# EAGLE design ACCUMULATOR (EAGLE 9.5.2)
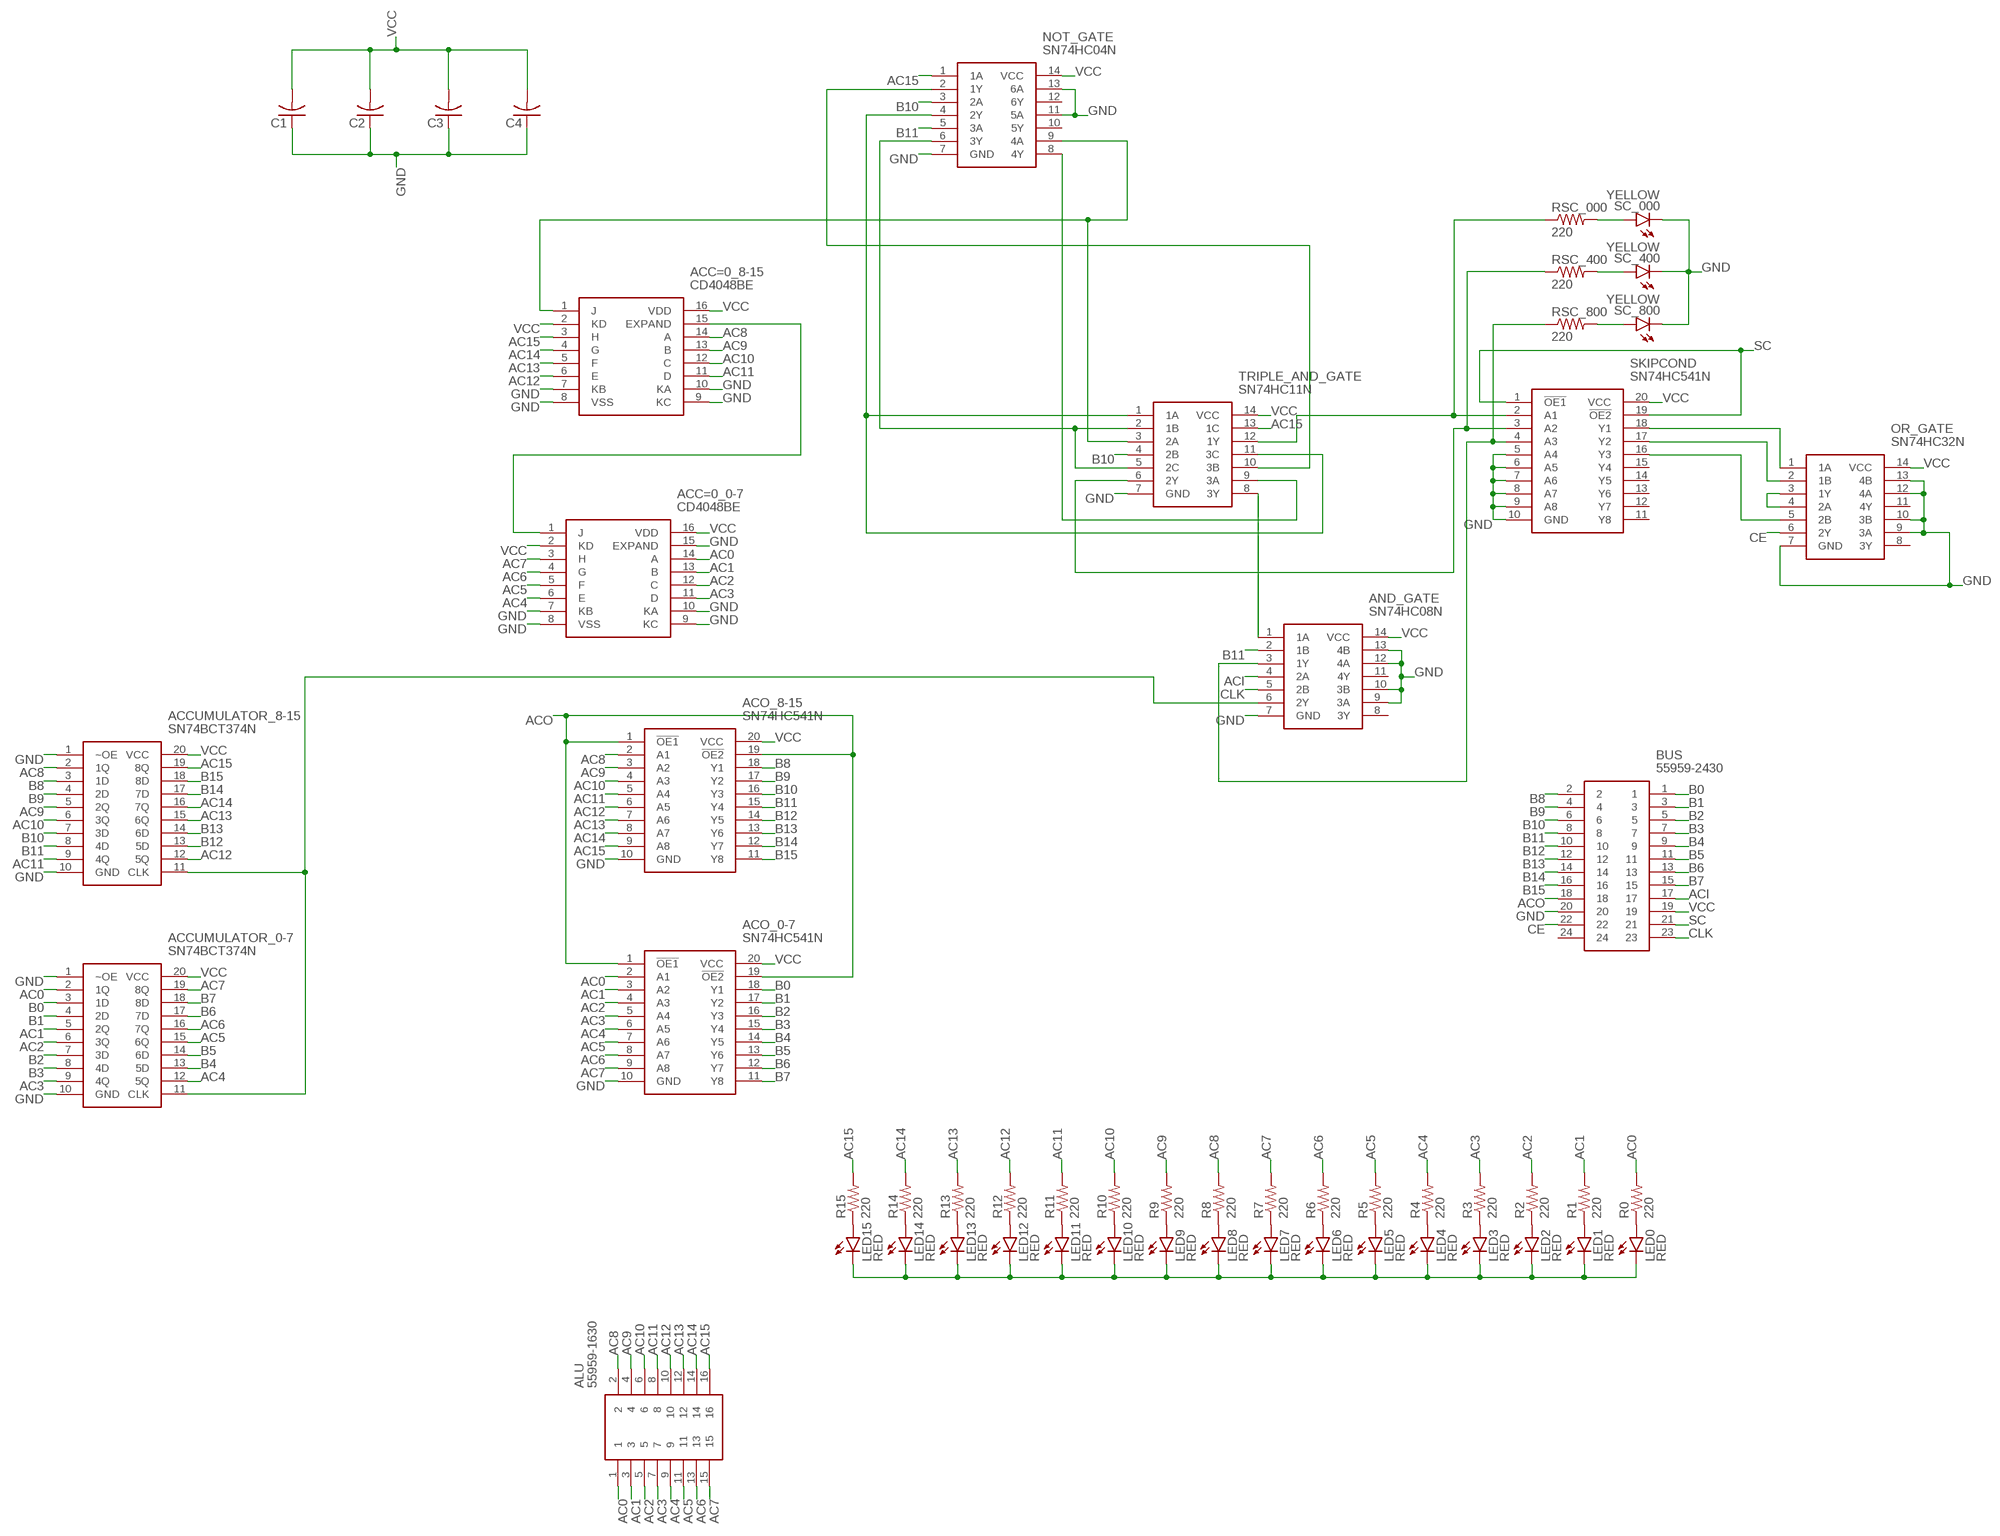
[diagram p0: schematic, sheet 1]

## Parts
ACC=0_0-7  CD4048BE  [DIP254P762X508-16]
ACC=0_8-15  CD4048BE  [DIP254P762X508-16]
ACCUMULATOR_0-7  SN74BCT374N  [DIP254P762X508-20]
ACCUMULATOR_8-15  SN74BCT374N  [DIP254P762X508-20]
ACO_0-7  SN74HC541N  [DIP794W53P254L2540H508Q20N]
ACO_8-15  SN74HC541N  [DIP794W53P254L2540H508Q20N]
ALU  55959-1630  [SHDR16W65P250X200_2X8_1940X140]
AND_GATE  SN74HC08N  [DIP794W53P254L1930H508Q14N]
BUS  55959-2430  [559592430]
C1  C-US025-024X044  [C025-024X044]
C2  C-US025-024X044  [C025-024X044]
C3  C-US025-024X044  [C025-024X044]
C4  C-US025-024X044  [C025-024X044]
LED0  RED  LED3MM  [LED3MM]
LED1  RED  LED3MM  [LED3MM]
LED2  RED  LED3MM  [LED3MM]
LED3  RED  LED3MM  [LED3MM]
LED4  RED  LED3MM  [LED3MM]
LED5  RED  LED3MM  [LED3MM]
LED6  RED  LED3MM  [LED3MM]
LED7  RED  LED3MM  [LED3MM]
LED8  RED  LED3MM  [LED3MM]
LED9  RED  LED3MM  [LED3MM]
LED10  RED  LED3MM  [LED3MM]
LED11  RED  LED3MM  [LED3MM]
LED12  RED  LED3MM  [LED3MM]
LED13  RED  LED3MM  [LED3MM]
LED14  RED  LED3MM  [LED3MM]
LED15  RED  LED3MM  [LED3MM]
NOT_GATE  SN74HC04N  [DIP794W53P254L1930H508Q14N]
OR_GATE  SN74HC32N  [DIP794W53P254L1930H508Q14N]
R0  220  R-US_0204/7  [0204/7]
R1  220  R-US_0204/7  [0204/7]
R2  220  R-US_0204/7  [0204/7]
R3  220  R-US_0204/7  [0204/7]
R4  220  R-US_0204/7  [0204/7]
R5  220  R-US_0204/7  [0204/7]
R6  220  R-US_0204/7  [0204/7]
R7  220  R-US_0204/7  [0204/7]
R8  220  R-US_0204/7  [0204/7]
R9  220  R-US_0204/7  [0204/7]
R10  220  R-US_0204/7  [0204/7]
R11  220  R-US_0204/7  [0204/7]
R12  220  R-US_0204/7  [0204/7]
R13  220  R-US_0204/7  [0204/7]
R14  220  R-US_0204/7  [0204/7]
R15  220  R-US_0204/7  [0204/7]
RSC_000  220  R-US_0204/7  [0204/7]
RSC_400  220  R-US_0204/7  [0204/7]
RSC_800  220  R-US_0204/7  [0204/7]
SC_000  YELLOW  LED3MM  [LED3MM]
SC_400  YELLOW  LED3MM  [LED3MM]
SC_800  YELLOW  LED3MM  [LED3MM]
SKIPCOND  SN74HC541N  [DIP794W53P254L2540H508Q20N]
TRIPLE_AND_GATE  SN74HC11N  [DIP794W53P254L1930H508Q14N]

## Nets
AC0: ACC=0_0-7.14(A) ACCUMULATOR_0-7.2(1Q) ACO_0-7.2(A1) ALU.1 R0.2
AC1: ACC=0_0-7.13(B) ACCUMULATOR_0-7.5(2Q) ACO_0-7.3(A2) ALU.3 R1.2
AC2: ACC=0_0-7.12(C) ACCUMULATOR_0-7.6(3Q) ACO_0-7.4(A3) ALU.5 R2.2
AC3: ACC=0_0-7.11(D) ACCUMULATOR_0-7.9(4Q) ACO_0-7.5(A4) ALU.7 R3.2
AC4: ACC=0_0-7.6(E) ACCUMULATOR_0-7.12(5Q) ACO_0-7.6(A5) ALU.9 R4.2
AC5: ACC=0_0-7.5(F) ACCUMULATOR_0-7.15(6Q) ACO_0-7.7(A6) ALU.11 R5.2
AC6: ACC=0_0-7.4(G) ACCUMULATOR_0-7.16(7Q) ACO_0-7.8(A7) ALU.13 R6.2
AC7: ACC=0_0-7.3(H) ACCUMULATOR_0-7.19(8Q) ACO_0-7.9(A8) ALU.15 R7.2
AC8: ACC=0_8-15.14(A) ACCUMULATOR_8-15.2(1Q) ACO_8-15.2(A1) ALU.2 R8.2
AC9: ACC=0_8-15.13(B) ACCUMULATOR_8-15.5(2Q) ACO_8-15.3(A2) ALU.4 R9.2
AC10: ACC=0_8-15.12(C) ACCUMULATOR_8-15.6(3Q) ACO_8-15.4(A3) ALU.6 R10.2
AC11: ACC=0_8-15.11(D) ACCUMULATOR_8-15.9(4Q) ACO_8-15.5(A4) ALU.8 R11.2
AC12: ACC=0_8-15.6(E) ACCUMULATOR_8-15.12(5Q) ACO_8-15.6(A5) ALU.10 R12.2
AC13: ACC=0_8-15.5(F) ACCUMULATOR_8-15.15(6Q) ACO_8-15.7(A6) ALU.12 R13.2
AC14: ACC=0_8-15.4(G) ACCUMULATOR_8-15.16(7Q) ACO_8-15.8(A7) ALU.14 R14.2
AC15: ACC=0_8-15.3(H) ACCUMULATOR_8-15.19(8Q) ACO_8-15.9(A8) ALU.16 NOT_GATE.1(1A) R15.2 TRIPLE_AND_GATE.13(1C)
ACI: AND_GATE.4(2A) BUS.17
ACO: ACO_0-7.1(!OE1) ACO_0-7.19(!OE2) ACO_8-15.1(!OE1) ACO_8-15.19(!OE2) BUS.18
B0: ACCUMULATOR_0-7.3(1D) ACO_0-7.18(Y1) BUS.1
B1: ACCUMULATOR_0-7.4(2D) ACO_0-7.17(Y2) BUS.3
B2: ACCUMULATOR_0-7.7(3D) ACO_0-7.16(Y3) BUS.5
B3: ACCUMULATOR_0-7.8(4D) ACO_0-7.15(Y4) BUS.7
B4: ACCUMULATOR_0-7.13(5D) ACO_0-7.14(Y5) BUS.9
B5: ACCUMULATOR_0-7.14(6D) ACO_0-7.13(Y6) BUS.11
B6: ACCUMULATOR_0-7.17(7D) ACO_0-7.12(Y7) BUS.13
B7: ACCUMULATOR_0-7.18(8D) ACO_0-7.11(Y8) BUS.15
B8: ACCUMULATOR_8-15.3(1D) ACO_8-15.18(Y1) BUS.2
B9: ACCUMULATOR_8-15.4(2D) ACO_8-15.17(Y2) BUS.4
B10: ACCUMULATOR_8-15.7(3D) ACO_8-15.16(Y3) BUS.6 NOT_GATE.3(2A) TRIPLE_AND_GATE.4(2B)
B11: ACCUMULATOR_8-15.8(4D) ACO_8-15.15(Y4) AND_GATE.2(1B) BUS.8 NOT_GATE.5(3A)
B12: ACCUMULATOR_8-15.13(5D) ACO_8-15.14(Y5) BUS.10
B13: ACCUMULATOR_8-15.14(6D) ACO_8-15.13(Y6) BUS.12
B14: ACCUMULATOR_8-15.17(7D) ACO_8-15.12(Y7) BUS.14
B15: ACCUMULATOR_8-15.18(8D) ACO_8-15.11(Y8) BUS.16
CE: BUS.22 OR_GATE.6(2Y)
CLK: AND_GATE.5(2B) BUS.23
GND: ACC=0_0-7.7(KB) ACC=0_0-7.8(VSS) ACC=0_0-7.9(KC) ACC=0_0-7.10(KA) ACC=0_0-7.15(EXPAND) ACC=0_8-15.7(KB) ACC=0_8-15.8(VSS) ACC=0_8-15.9(KC) ACC=0_8-15.10(KA) ACCUMULATOR_0-7.1(~OE) ACCUMULATOR_0-7.10(GND) ACCUMULATOR_8-15.1(~OE) ACCUMULATOR_8-15.10(GND) ACO_0-7.10(GND) ACO_8-15.10(GND) AND_GATE.7(GND) AND_GATE.9(3A) AND_GATE.10(3B) AND_GATE.12(4A) AND_GATE.13(4B) BUS.20 C1.1 C2.1 C3.1 C4.1 NOT_GATE.7(GND) NOT_GATE.11(5A) NOT_GATE.13(6A) OR_GATE.7(GND) OR_GATE.9(3A) OR_GATE.10(3B) OR_GATE.12(4A) OR_GATE.13(4B) SC_000.K(C) SC_400.K(C) SC_800.K(C) SKIPCOND.5(A4) SKIPCOND.6(A5) SKIPCOND.7(A6) SKIPCOND.8(A7) SKIPCOND.9(A8) SKIPCOND.10(GND) TRIPLE_AND_GATE.7(GND)
N$1: ACC=0_0-7.1(J) ACC=0_8-15.15(EXPAND)
N$2: RSC_800.2 SC_800.A
N$3: RSC_400.2 SC_400.A
N$4: NOT_GATE.4(2Y) TRIPLE_AND_GATE.1(1A) TRIPLE_AND_GATE.11(3C)
N$5: ACCUMULATOR_0-7.11(CLK) ACCUMULATOR_8-15.11(CLK) AND_GATE.6(2Y)
N$6: ACC=0_8-15.1(J) NOT_GATE.9(4A) TRIPLE_AND_GATE.3(2A)
N$7: NOT_GATE.6(3Y) TRIPLE_AND_GATE.2(1B) TRIPLE_AND_GATE.5(2C)
N$8: RSC_400.1 SKIPCOND.3(A2) TRIPLE_AND_GATE.6(2Y)
N$9: RSC_000.1 SKIPCOND.2(A1) TRIPLE_AND_GATE.12(1Y)
N$10: RSC_000.2 SC_000.A
N$11: LED0.K(C) LED1.K(C) LED2.K(C) LED3.K(C) LED4.K(C) LED5.K(C) LED6.K(C) LED7.K(C) LED8.K(C) LED9.K(C) LED10.K(C) LED11.K(C) LED12.K(C) LED13.K(C) LED14.K(C) LED15.K(C)
N$12: NOT_GATE.8(4Y) TRIPLE_AND_GATE.9(3A)
N$13: NOT_GATE.2(1Y) TRIPLE_AND_GATE.10(3B)
N$14: LED1.A R1.1
N$15: AND_GATE.1(1A) TRIPLE_AND_GATE.8(3Y)
N$16: LED2.A R2.1
N$17: AND_GATE.3(1Y) RSC_800.1 SKIPCOND.4(A3)
N$18: LED3.A R3.1
N$19: LED4.A R4.1
N$20: LED5.A R5.1
N$21: LED6.A R6.1
N$22: LED7.A R7.1
N$23: LED8.A R8.1
N$24: LED9.A R9.1
N$25: LED10.A R10.1
N$26: LED11.A R11.1
N$27: LED12.A R12.1
N$28: LED13.A R13.1
N$29: LED14.A R14.1
N$30: LED15.A R15.1
N$31: LED0.A R0.1
N$32: OR_GATE.1(1A) SKIPCOND.18(Y1)
N$33: OR_GATE.2(1B) SKIPCOND.17(Y2)
N$34: OR_GATE.3(1Y) OR_GATE.4(2A)
N$35: OR_GATE.5(2B) SKIPCOND.16(Y3)
SC: BUS.21 SKIPCOND.1(!OE1) SKIPCOND.19(!OE2)
VCC: ACC=0_0-7.2(KD) ACC=0_0-7.16(VDD) ACC=0_8-15.2(KD) ACC=0_8-15.16(VDD) ACCUMULATOR_0-7.20(VCC) ACCUMULATOR_8-15.20(VCC) ACO_0-7.20(VCC) ACO_8-15.20(VCC) AND_GATE.14(VCC) BUS.19 C1.2 C2.2 C3.2 C4.2 NOT_GATE.14(VCC) OR_GATE.14(VCC) SKIPCOND.20(VCC) TRIPLE_AND_GATE.14(VCC)
Unconnected: AND_GATE.8(3Y) AND_GATE.11(4Y) BUS.24 NOT_GATE.10(5Y) NOT_GATE.12(6Y) OR_GATE.8(3Y) OR_GATE.11(4Y) SKIPCOND.11(Y8) SKIPCOND.12(Y7) SKIPCOND.13(Y6) SKIPCOND.14(Y5) SKIPCOND.15(Y4)

## Library data of the parts
ACC=0_0-7 ACC=0_8-15 = SamacSys_Parts:CD4048BE: CMOS multifunction expandable 8-input gate Source: Datasheet <http://componentsearchengine.com/Datasheets/1/CD4048BE.pdf>; DESCRIPTION: CMOS multifunction expandable 8-input gate; HEIGHT: mm; MANUFACTURER_NAME: Texas Instruments; MANUFACTURER_PART_NUMBER: CD4048BE; MOUSER_PART_NUMBER: 595-CD4048BE; MOUSER_PRICE-STOCK: https://www.mouser.com/Search/Refine.aspx?Keyword=595-CD4048BE
ACCUMULATOR_0-7 ACCUMULATOR_8-15 = SamacSys_Parts:SN74BCT374N: OCTAL EDGE TRIGGERED D TYPE LATCHES Source: Datasheet; DESCRIPTION: OCTAL EDGE TRIGGERED D TYPE LATCHES; HEIGHT: mm; MANUFACTURER_NAME: Texas Instruments; MANUFACTURER_PART_NUMBER: SN74BCT374N; MOUSER_PART_NUMBER: 595-SN74BCT374N; MOUSER_PRICE-STOCK: https://www.mouser.com/Search/Refine.aspx?Keyword=595-SN74BCT374N
ACO_0-7 ACO_8-15 SKIPCOND = SamacSys_Parts:SN74HC541N: Octal Buffers And Line Drivers With 3-State Outputs Source: Datasheet <http://componentsearchengine.com/Datasheets/3/SN74HC541N.pdf>; DESCRIPTION: Octal Buffers And Line Drivers With 3-State Outputs; HEIGHT: 5.08mm; MANUFACTURER_NAME: Texas Instruments; MANUFACTURER_PART_NUMBER: SN74HC541N; MOUSER_PART_NUMBER: 595-SN74HC541N; MOUSER_PRICE-STOCK: https://www.mouser.com/Search/Refine.aspx?Keyword=595-SN74HC541N
ALU = SamacSys_Parts:55959-1630: Molex MICROCLASP Series, Series Number 55959, 2mm Pitch 16 Way 2 Row Right Angle PCB Header, Solder Termination, 3A Source: Datasheet <https://componentsearchengine.com/Datasheets/1/55959-1630.pdf>; DESCRIPTION: Molex MICROCLASP Series, Series Number 55959, 2mm Pitch 16 Way 2 Row Right Angle PCB Header, Solder Termination, 3A; HEIGHT: 11.7mm; MANUFACTURER_NAME: Molex; MANUFACTURER_PART_NUMBER: 55959-1630; MOUSER_PART_NUMBER: 538-55959-1630; MOUSER_PRICE-STOCK: https://www.mouser.com/Search/Refine.aspx?Keyword=538-55959-1630
AND_GATE = SamacSys_Parts:SN74HC08N: QUADRUPLE 2-INPUT POSITIVE-NOR GATES Source: Datasheet <http://componentsearchengine.com/Datasheets/1/SN74HC08N.pdf>; DESCRIPTION: QUADRUPLE 2-INPUT POSITIVE-NOR GATES; HEIGHT: 5.08mm; MANUFACTURER_NAME: Texas Instruments; MANUFACTURER_PART_NUMBER: SN74HC08N; MOUSER_PART_NUMBER: 595-SN74HC08N; MOUSER_PRICE-STOCK: https://www.mouser.com/Search/Refine.aspx?Keyword=595-SN74HC08N
BUS = SamacSys_Parts:55959-2430: Headers & Wire Housings 24 Ckt R.A. Header Source: Datasheet <https://componentsearchengine.com/Datasheets/1/55959-2430.pdf>; DESCRIPTION: Headers & Wire Housings 24 Ckt R.A. Header; HEIGHT: 11.95mm; MANUFACTURER_NAME: Molex; MANUFACTURER_PART_NUMBER: 55959-2430; MOUSER_PART_NUMBER: 538-55959-2430; MOUSER_PRICE-STOCK: https://www.mouser.com/Search/Refine.aspx?Keyword=538-55959-2430
C1-C4 = rcl:C-US: CAPACITOR, American symbol; SPICEPREFIX: C
LED0 LED1-LED15 SC_000 SC_400 SC_800 = led:LED: LED OSRAM: - CHIPLED LG R971, LG N971, LY N971, LG Q971, LY Q971, LO R971, LY R971 LH N974, LH R974 LS Q976, LO Q976, LY Q976 LO Q996 - Hyper CHIPLED LW Q18S LB Q993, LB Q99A, LB R99A - SideLED LS A670, LO A670, LY A670, LG A670, LP A670 LB A673, LV A673, LT A673, LW A673 LH A674 LY A675 LS A676, LA A676, LO A676, LY A676, LW A676 LS A679, LY A679, LG A679 - Hyper Micro SIDELED® LS Y876, LA Y876, LO Y876, LY Y876 LT Y87S - SmartLED LW L88C, LW L88S LB L89C, LB L89S, LG L890 LS L89K, LO L89K, LY L89K LS L896, LA L896, LO L896, LY L896 - TOPLED LS T670, LO T670, LY T670, LG T670, LP T670 LSG T670, LSP T670, LSY T670, LOP T670, LYG T670 LG T671, LOG T671, LSG T671 LB T673, LV T673, LT T673, LW T673 LH T674 LS T676, LA T676, LO T676, LY T676, LB T676, LH T676, LSB T676, LW T676 LB T67C, LV T67C, LT T67C, LS T67K, LO T67K, LY T67K, LW E67C LS E67B, LA E67B, LO E67B, LY E67B, LB E67C, LV E67C, LT E67C LW T67C LS T679, LY T679, LG T679 LS T770, LO T770, LY T770, LG T770, LP T770 LB T773, LV T773, LT T773, LW T773 LH T774 LS E675, LA E675, LY E675, LS T675 LS T776, LA T776, LO T776, LY T776, LB T776 LHGB T686 LT T68C, LB T68C - Hyper Mini TOPLED® LB M676 - Mini TOPLED Santana® LG M470 LS M47K, LO M47K, LY M47K Source: http://www.osram.convergy.de LUXEON: - LUMILED® LXK2-PW12-R00, LXK2-PW12-S00, LXK2-PW14-U00, LXK2-PW14-V00 LXK2-PM12-R00, LXK2-PM12-S00, LXK2-PM14-U00 LXK2-PE12-Q00, LXK2-PE12-R00, LXK2-PE12-S00, LXK2-PE14-T00, LXK2-PE14-U00 LXK2-PB12-K00, LXK2-PB12-L00, LXK2-PB12-M00, LXK2-PB14-N00, LXK2-PB14-P00, LXK2-PB14-Q00 LXK2-PR12-L00, LXK2-PR12-M00, LXK2-PR14-Q00, LXK2-PR14-R00 LXK2-PD12-Q00, LXK2-PD12-R00, LXK2-PD12-S00 LXK2-PH12-R00, LXK2-PH12-S00 LXK2-PL12-P00, LXK2-PL12-Q00, LXK2-PL12-R00 Source: www.luxeon.com KINGBRIGHT: KA-3528ASYC Source: www.kingbright.com
NOT_GATE = SamacSys_Parts:SN74HC04N: Hex inverter,SN74HC04N DIP14 2.6V 25pcs Source: Datasheet <http://www.ti.com/lit/gpn/sn74hc04>; DESCRIPTION: Hex inverter,SN74HC04N DIP14 2.6V 25pcs; HEIGHT: 5.08mm; MANUFACTURER_NAME: Texas Instruments; MANUFACTURER_PART_NUMBER: SN74HC04N; MOUSER_PART_NUMBER: 595-SN74HC04N; MOUSER_PRICE-STOCK: https://www.mouser.com/Search/Refine.aspx?Keyword=595-SN74HC04N
OR_GATE = SamacSys_Parts:SN74HC32N: QUADRUPLE 2-INPUT POSITIVE-OR GATES Source: Datasheet <http://www.ti.com/lit/gpn/sn74hc32>; DESCRIPTION: QUADRUPLE 2-INPUT POSITIVE-OR GATES; HEIGHT: 5.08mm; MANUFACTURER_NAME: Texas Instruments; MANUFACTURER_PART_NUMBER: SN74HC32N; MOUSER_PART_NUMBER: 595-SN74HC32N; MOUSER_PRICE-STOCK: https://www.mouser.com/Search/Refine.aspx?Keyword=595-SN74HC32N
R0 R1-R15 RSC_000 RSC_400 RSC_800 = rcl:R-US_: RESISTOR, American symbol; SPICEPREFIX: R
TRIPLE_AND_GATE = SamacSys_Parts:SN74HC11N: Triple 3-Input AND Gate SN74HC11N Source: Datasheet <http://componentsearchengine.com/Datasheets/1/SN74HC11N.pdf>; DESCRIPTION: Triple 3-Input AND Gate SN74HC11N; HEIGHT: 5.08mm; MANUFACTURER_NAME: Texas Instruments; MANUFACTURER_PART_NUMBER: SN74HC11N; MOUSER_PART_NUMBER: 595-SN74HC11N; MOUSER_PRICE-STOCK: https://www.mouser.com/Search/Refine.aspx?Keyword=595-SN74HC11N

## Board
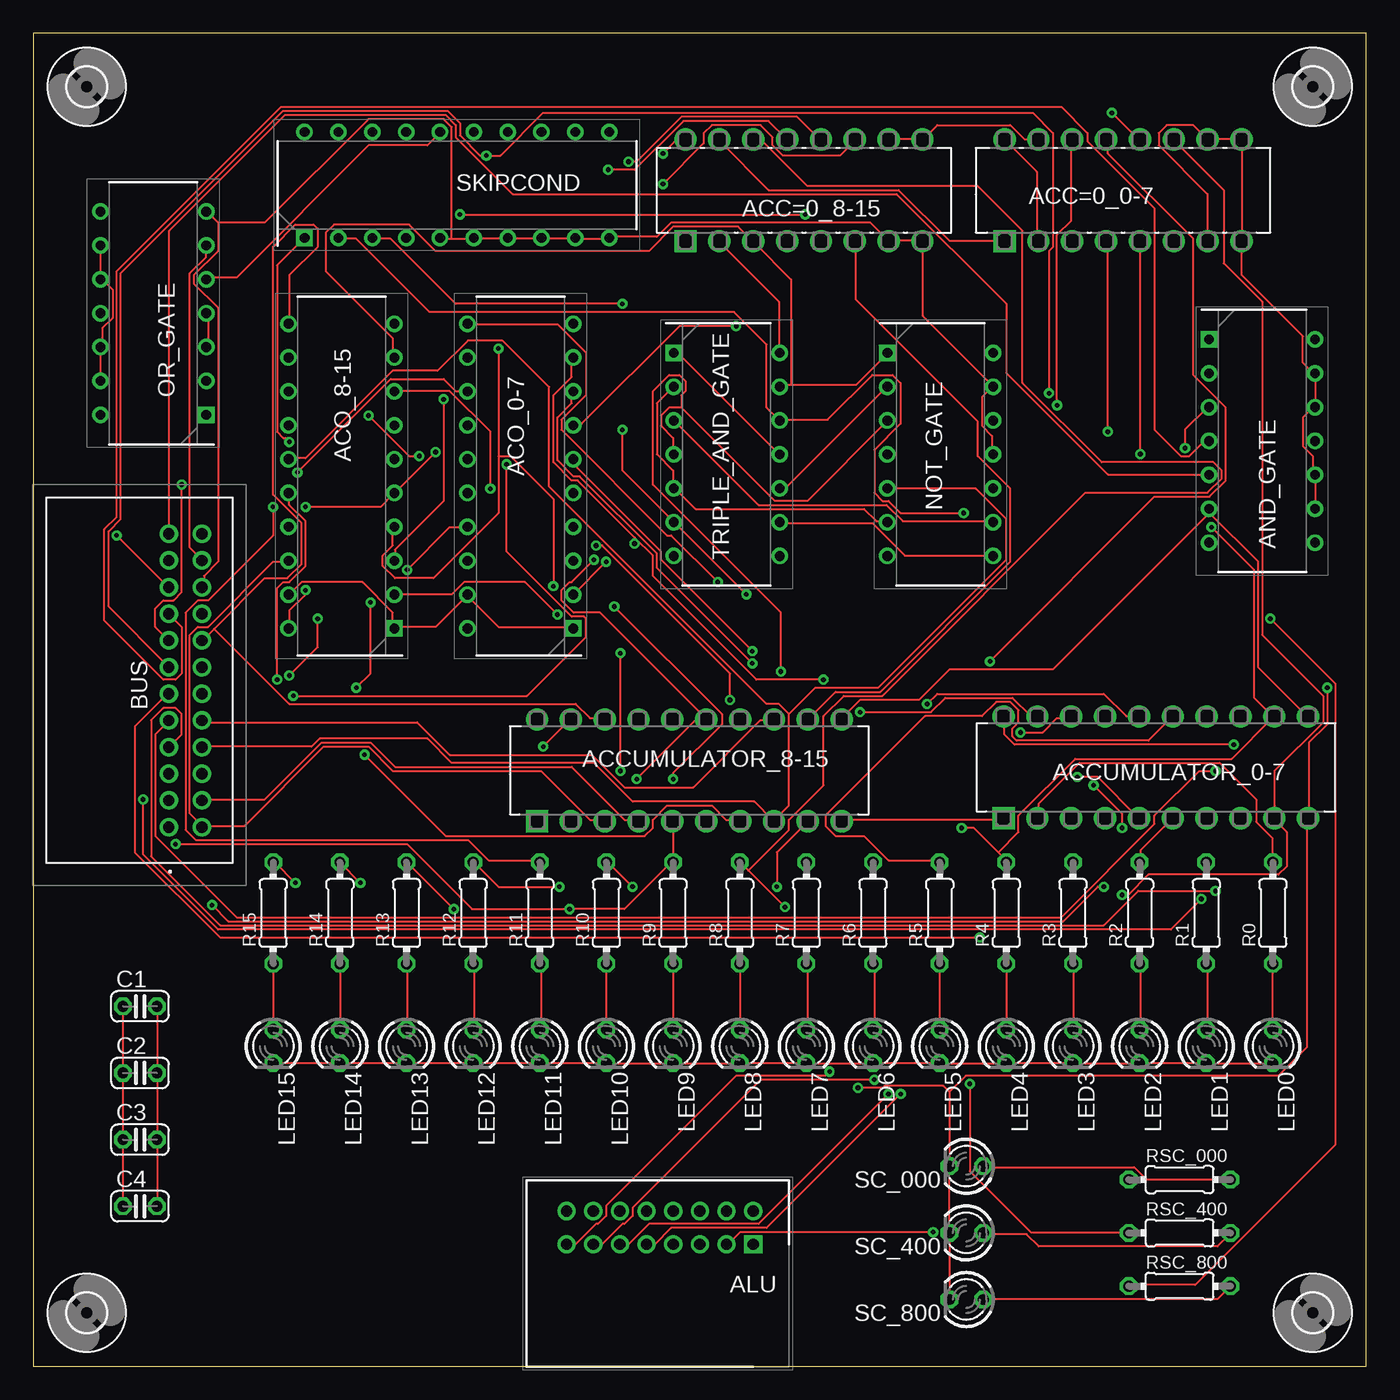
[diagram p1: board, top side]
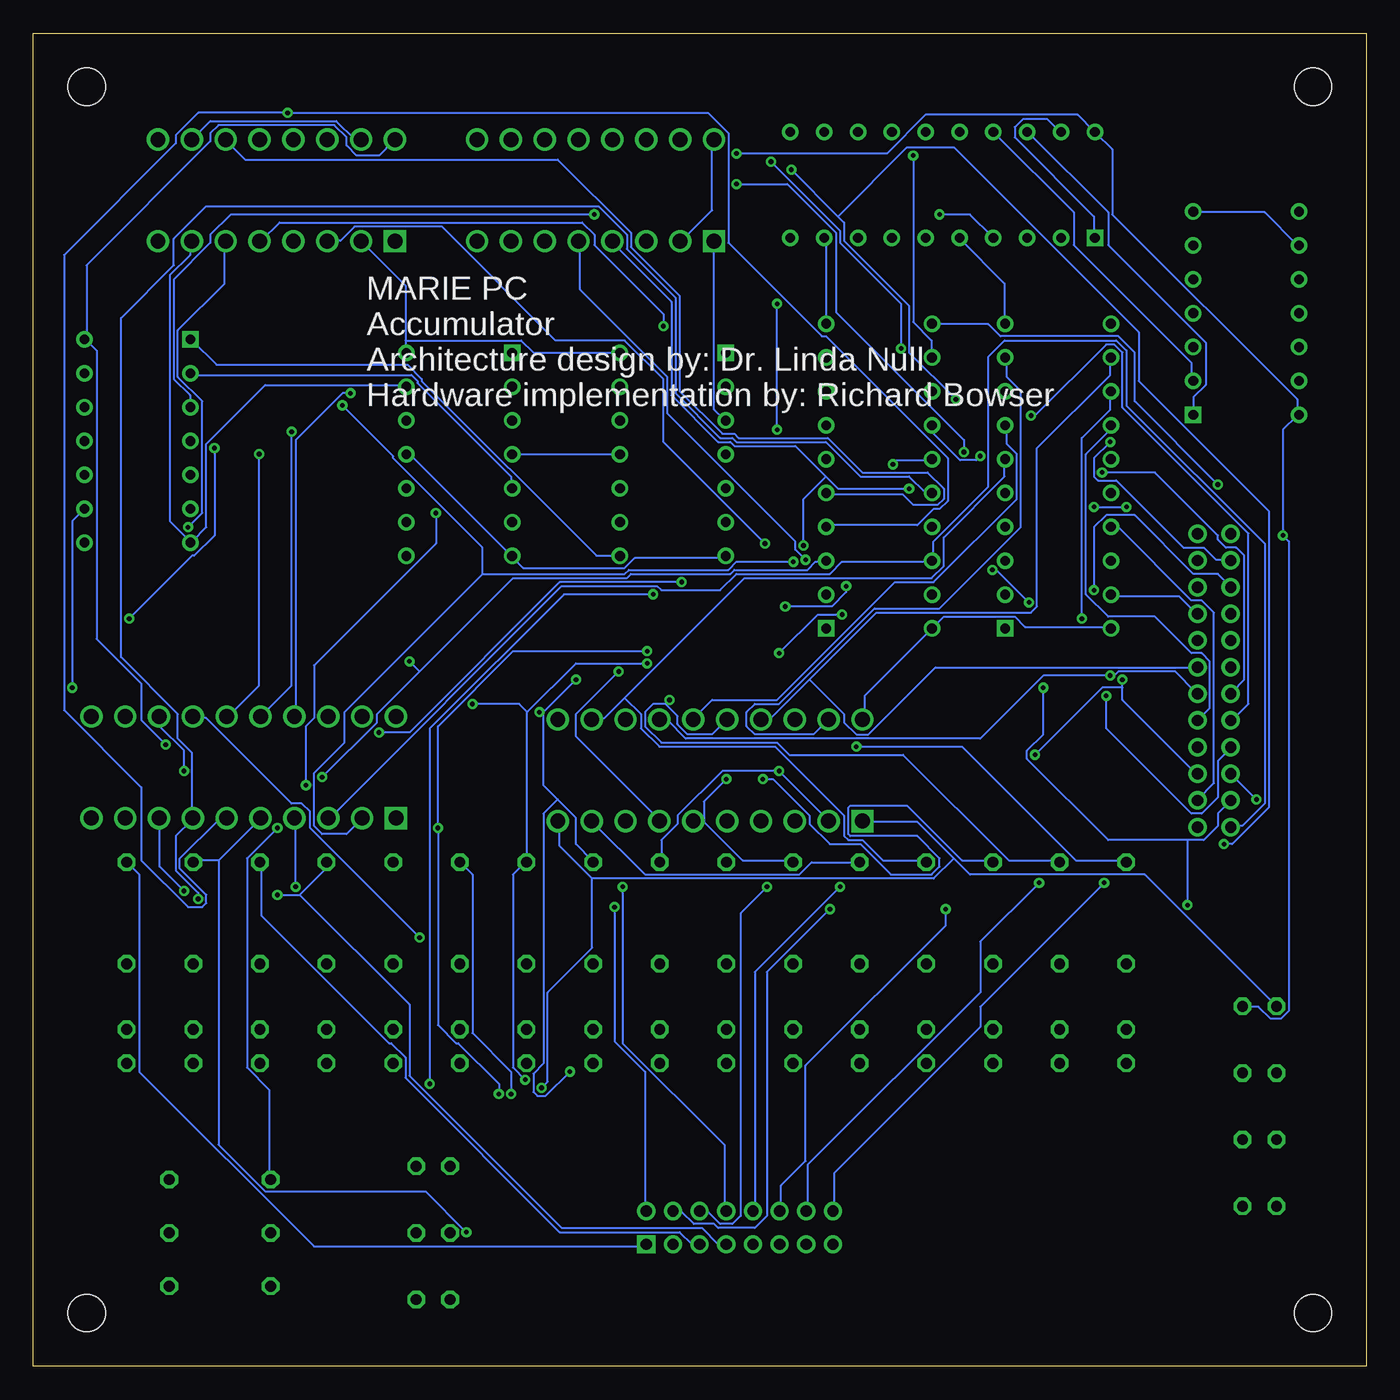
[diagram p2: board, bottom side, seen from below]

Size 100 x 100 mm. Coordinates in mm from the lower left corner, seen from the top.
Outline: 0,0 100,0 100,100 0,100 0,0
Copper layers (1*16): Top 0.035mm / dielectric 1.5mm / Bottom 0.035mm
Design rules "default": minimum track width 6mil, minimum drill 0.35mm, track to track 6mil, track to pad 6mil, pad to pad 6mil, via to via 6mil, smd to smd 6mil, copper to edge 40mil, drill to drill 6mil, minimum pad ring 10mil, minimum via ring 8mil, stop-mask expansion 4mil, vias tented up to drill 0mil, thermal gap 10mil

### Footprints (pad centres in the part's own frame; a part is rotated, then mirrored left to right if it is on the bottom)
DIP254P762X508-16 = drill 1.118 pad 1.676 square: 1 -7.62,17.78 | drill 1.118 pad 1.676: 2 -7.62,15.24; 3 -7.62,12.7; 4 -7.62,10.16; 5 -7.62,7.62; 6 -7.62,5.08; 7 -7.62,2.54; 8 -7.62,0; 9 0,0; 10 0,2.54; 11 0,5.08; 12 0,7.62; 13 0,10.16; 14 0,12.7; 15 0,15.24; 16 0,17.78
DIP254P762X508-20 = drill 1.118 pad 1.676 square: 1 -7.62,22.86 | drill 1.118 pad 1.676: 2 -7.62,20.32; 3 -7.62,17.78; 4 -7.62,15.24; 5 -7.62,12.7; 6 -7.62,10.16; 7 -7.62,7.62; 8 -7.62,5.08; 9 -7.62,2.54; 10 -7.62,0; 11 0,0; 12 0,2.54; 13 0,5.08; 14 0,7.62; 15 0,10.16; 16 0,12.7; 17 0,15.24; 18 0,17.78; 19 0,20.32; 20 0,22.86
DIP794W53P254L2540H508Q20N = drill 0.73 pad 1.13 square: 1 -3.97,11.43 | drill 0.73 pad 1.13: 2 -3.97,8.89; 3 -3.97,6.35; 4 -3.97,3.81; 5 -3.97,1.27; 6 -3.97,-1.27; 7 -3.97,-3.81; 8 -3.97,-6.35; 9 -3.97,-8.89; 10 -3.97,-11.43; 11 3.97,-11.43; 12 3.97,-8.89; 13 3.97,-6.35; 14 3.97,-3.81; 15 3.97,-1.27; 16 3.97,1.27; 17 3.97,3.81; 18 3.97,6.35; 19 3.97,8.89; 20 3.97,11.43
SHDR16W65P250X200_2X8_1940X140 = drill 0.85 pad 1.275 square: 1 0,0 | drill 0.85 pad 1.275: 2 0,2.5; 3 -2,0; 4 -2,2.5; 5 -4,0; 6 -4,2.5; 7 -6,0; 8 -6,2.5; 9 -8,0; 10 -8,2.5; 11 -10,0; 12 -10,2.5; 13 -12,0; 14 -12,2.5; 15 -14,0; 16 -14,2.5
DIP794W53P254L1930H508Q14N = drill 0.73 pad 1.13 square: 1 -3.97,7.62 | drill 0.73 pad 1.13: 2 -3.97,5.08; 3 -3.97,2.54; 4 -3.97,0; 5 -3.97,-2.54; 6 -3.97,-5.08; 7 -3.97,-7.62; 8 3.97,-7.62; 9 3.97,-5.08; 10 3.97,-2.54; 11 3.97,0; 12 3.97,2.54; 13 3.97,5.08; 14 3.97,7.62
559592430 = drill 0.85 pad 1.381: 1 0,0; 2 0,-2.5; 3 2,0; 4 2,-2.5; 5 4,0; 6 4,-2.5; 7 6,0; 8 6,-2.5; 9 8,0; 10 8,-2.5; 11 10,0; 12 10,-2.5; 13 12,0; 14 12,-2.5; 15 14,0; 16 14,-2.5; 17 16,0; 18 16,-2.5; 19 18,0; 20 18,-2.5; 21 20,0; 22 20,-2.5; 23 22,0; 24 22,-2.5
C025-024X044 = drill 0.813 octagon: 1 -1.27,0; 2 1.27,0
LED3MM = drill 0.813 octagon: A -1.27,0; K 1.27,0
0204/7 = drill 0.813 octagon: 1 -3.81,0; 2 3.81,0
2,8 = hole 2.8: 0,0

### Placement (x,y rotation side)
ACC=0_0-7  90.65,92.03 90 top
ACC=0_8-15  66.71,92.03 90 top
ACCUMULATOR_0-7  95.65,48.74 90 top
ACCUMULATOR_8-15  60.65,48.52 90 top
ACO_0-7  36.55,66.78 180 top
ACO_8-15  23.12,66.78 180 top
ALU  54.01,9.14 0 top
AND_GATE  92.19,69.41 0 top
BUS  10.16,40.45 90 top
C1  8,27 0 top
C2  8,22 0 top
C3  8,17 0 top
C4  8,12 0 top
LED0  93,24 270 top
LED1  88,24 270 top
LED2  83,24 270 top
LED3  78,24 270 top
LED4  73,24 270 top
LED5  68,24 270 top
LED6  63,24 270 top
LED7  58,24 270 top
LED8  53,24 270 top
LED9  48,24 270 top
LED10  43,24 270 top
LED11  38,24 270 top
LED12  33,24 270 top
LED13  28,24 270 top
LED14  23,24 270 top
LED15  18,24 270 top
NOT_GATE  68.05,68.41 0 top
OR_GATE  9,79 180 top
R0  93,34 90 top
R1  88,34 90 top
R2  83,34 90 top
R3  78,34 90 top
R4  73,34 90 top
R5  68,34 90 top
R6  63,34 90 top
R7  58,34 90 top
R8  53,34 90 top
R9  48,34 90 top
R10  43,34 90 top
R11  38,34 90 top
R12  33,34 90 top
R13  28,34 90 top
R14  23,34 90 top
R15  18,34 90 top
RSC_000  86,14 0 top
RSC_400  86,10 0 top
RSC_800  86,6 0 top
SC_000  70,15 180 top
SC_400  70,10 180 top
SC_800  70,5 180 top
SKIPCOND  31.78,88.62 90 top
TRIPLE_AND_GATE  52.02,68.41 0 top
U$1  [2,8]  4,4 0 top
U$2  [2,8]  96,4 0 top
U$3  [2,8]  96,96 0 top
U$4  [2,8]  4,96 0 top

### Tracks (layer width: path | path; a pad name or v marks a point on that pad's centre or on a via)
AC0  (via drill 0.35)
  Top 0.152: v42.98,60.35 40.54,57.91 ACO_0-7.2 | R0.2 92.96,37.95 92.96,39.62 91.75,40.84 91.75,42.52 89,45.26 78.49,45.26 75.44,42.22 75.44,41.15 ACCUMULATOR_0-7.2 | v76.81,72.08 76.81,84.89 77.88,85.95 77.88,91.9 ACC=0_0-7.14
  Bottom 0.152: v42.98,60.35 47.24,60.35 47.85,59.74 55.32,59.74 55.63,59.44 66.29,59.44 | 66.29,59.44 76.66,49.07 76.66,46.79 78.94,44.5 78.94,40.54 78.33,39.93 76.5,39.93 75.44,41 ACCUMULATOR_0-7.2 | ALU.1 54.1,8.99 78.94,8.99 92.05,22.1 92.05,36.88 92.96,37.8 R0.2 | v76.81,72.08 73,68.28 73,68.12 66.29,61.42 66.29,59.44
AC1  (via drill 0.35)
  Top 0.152: v78.33,44.2 79.86,44.2 82.91,41.15 ACCUMULATOR_0-7.5 | v67.51,10.06 53.03,10.06 52.12,9.14 ALU.3 | v71.78,52.88 84.12,65.23 88.24,65.23 89.46,66.45 89.46,71.93 87.02,74.37 87.02,84.58 80.62,90.98 80.62,91.9 ACC=0_0-7.13
  Bottom 0.152: 71.02,52.12 74.22,48.92 74.22,48.31 v78.33,44.2 | 71.02,52.12 64.01,59.13 55.47,59.13 55.17,59.44 47.7,59.44 47.4,59.74 41.91,59.74 41.3,60.35 40.54,60.35 ACO_0-7.3 | 86.11,37.95 87.94,37.95 R1.2 | 86.11,37.95 83.06,41 ACCUMULATOR_0-7.5 | v67.51,10.06 70.56,13.11 82.6,13.11 86.11,16.61 86.11,37.95 | 71.02,52.12 v71.78,52.88
AC2  (via drill 0.35)
  Top 0.152: R2.2 83.06,37.95 83.06,38.71 85.34,41 ACCUMULATOR_0-7.6 | v80.92,94.03 82.91,92.05 ACC=0_0-7.12
  Bottom 0.152: ALU.5 50.14,9.14 50.6,9.14 51.51,10.06 60.5,10.06 72.08,21.64 72.08,23.16 73.15,24.23 73.3,24.23 82.91,33.83 82.91,37.8 R2.2 | ACO_0-7.4 40.39,63.09 33.68,63.09 32.46,64.31 32,64.31 31.39,64.92 31.39,68.12 40.54,77.27 40.84,77.27 47.85,84.28 47.85,92.51 49.38,94.03 v80.92,94.03 87.63,94.03 89.31,92.35 89.31,91.75 97.69,83.36 97.69,49.23 91.9,43.43 91.9,37.95 88.39,34.44 87.33,34.44 87.02,34.75 87.02,35.36 89,37.34 89,38.1 86.11,41 85.5,41 ACCUMULATOR_0-7.6
AC3  (via drill 0.35)
  Top 0.152: v81.69,35.36 82.14,35.36 83.67,36.88 93.42,36.88 94.03,37.49 94.03,40.08 93.12,41 ACCUMULATOR_0-7.9 93.12,41.15 93.12,44.65 96.77,48.31 96.77,50.29 92.2,54.86 92.2,79.86 89.31,82.75 89.31,88.24 85.65,91.9 ACC=0_0-7.11
  Bottom 0.152: 80.01,35.36 78.03,37.34 78.03,37.8 R3.2 | v81.69,35.36 80.01,35.36 | 80.01,35.36 71.78,27.13 71.78,21.79 60.35,10.36 49.84,10.36 48.62,9.14 48.16,9.14 ALU.7 | ACO_0-7.5 40.39,65.38 34.75,65.38 33.98,64.62 32.16,64.62 31.7,65.08 31.7,65.84 32.92,67.06 37.8,67.06 40.39,69.65 47.09,69.65 47.4,69.95 48.31,69.95 51.51,73.15 51.51,80.31 55.17,83.97 55.17,85.04 60.66,90.53 84.12,90.53 85.5,91.9 ACC=0_0-7.11
AC4  (via drill 0.35)
  Top 0.152: v53.95,53.65 47.09,60.5 47.09,61.11 40.54,67.67 40.54,67.97 ACO_0-7.6 | v69.65,40.39 70.56,40.39 72.39,38.56 | 72.39,38.56 73,37.95 R4.2 | v65.08,20.42 55.02,10.36 47.85,10.36 46.63,9.14 46.02,9.14 ALU.9 | 72.39,38.56 73.91,40.08 73.91,41.3 78.18,45.57 89.92,45.57 92.96,48.62 ACCUMULATOR_0-7.12 92.96,48.77 91.59,50.14 91.59,59.74 v88.39,62.94
  Bottom 0.152: v53.95,53.65 64.01,53.65 69.65,48.01 v69.65,40.39 69.65,25.6 68.28,24.23 68.12,24.23 65.08,21.18 v65.08,20.42 | v88.39,62.94 87.33,64.01 87.33,72.39 89.15,74.22 89.15,77.72 85.65,81.23 85.65,84.28 ACC=0_0-7.6
AC5  (via drill 0.35)
  Top 0.152: v52.73,78.03 48.46,78.03 41.15,70.71 40.54,70.71 ACO_0-7.7 | R5.2 67.97,37.95 64.16,37.95 62.33,39.78 60.2,39.78 59.44,40.54 59.44,41.3 66.9,48.77 71.17,48.77 72.24,49.84 73.3,49.84 73.91,49.23 73.91,48.31 73.46,47.85 73.46,47.24 73.76,46.94 83.67,46.94 85.34,48.62 ACCUMULATOR_0-7.15 | v64.16,20.42 54.41,10.67 46.18,10.67 44.65,9.14 44.04,9.14 ALU.11 | v83.06,68.43 83.06,84.28 ACC=0_0-7.5
  Bottom 0.152: v52.73,78.03 52.73,78.94 57.91,84.12 57.91,84.89 58.83,85.8 81.53,85.8 82.91,84.43 ACC=0_0-7.5 | v64.16,20.42 64.16,22.1 67.06,24.99 67.06,36.88 67.97,37.8 R5.2 | v83.06,68.43 83.06,51.05 85.34,48.77 ACCUMULATOR_0-7.15
AC6  (via drill 0.35)
  Top 0.152: v53.95,52.73 46.79,59.89 46.79,60.96 41,66.75 40.54,66.75 39.32,67.97 39.32,71.17 40.39,72.24 40.39,73 ACO_0-7.8 | v63.09,21.49 54.56,21.49 44.96,11.89 44.96,11.28 44.35,10.67 44.2,10.67 42.67,9.14 42.06,9.14 ALU.13 | v67.06,49.68 67.82,50.44 80.31,50.44 81.99,48.77 82.91,48.77 ACCUMULATOR_0-7.16 | v80.62,70.1 80.62,84.28 ACC=0_0-7.4
  Bottom 0.152: v53.95,52.73 59.28,52.73 62.94,49.07 | 62.94,49.07 62.94,37.95 R6.2 63.09,37.8 64.01,36.88 64.01,22.4 v63.09,21.49 | v67.06,49.68 63.55,49.68 62.94,49.07 | v80.62,70.1 80.62,51.05 82.91,48.77 ACCUMULATOR_0-7.16
AC7  (via drill 0.35)
  Top 0.152: 45.11,62.18 46.48,60.81 46.48,59.28 54.25,51.51 v59.28,51.51 | 45.11,62.18 40.84,66.45 40.39,66.45 39.01,67.82 39.01,72.85 40.39,74.22 40.39,75.59 ACO_0-7.9 | v59.74,22.1 59.44,21.79 52.73,21.79 42.98,12.04 42.98,11.28 42.37,10.67 42.22,10.67 40.69,9.14 40.08,9.14 ALU.15 | v62.03,49.07 67.36,49.07 68.43,50.14 73.46,50.14 74.83,48.77 75.29,48.77 ACCUMULATOR_0-7.19 | 45.11,62.18 v45.11,61.72
  Bottom 0.152: 61.72,49.07 v59.28,51.51 | 61.72,49.07 61.72,43.59 60.66,42.52 | 60.66,42.52 59.28,41.15 59.28,39.17 58.06,37.95 R7.2 | v59.74,22.1 61.57,20.27 62.18,20.27 62.48,20.57 62.48,21.95 61.72,22.71 61.72,41.45 60.66,42.52 | 61.72,49.07 v62.03,49.07 | v45.11,61.72 52.73,69.34 52.73,74.07 55.63,76.96 60.81,76.96 69.34,85.5 75.89,85.5 76.96,84.43 77.88,84.43 ACC=0_0-7.3
AC8  (via drill 0.35)
  Top 0.152: v39.32,56.39 36.88,58.83 32.31,58.83 31.39,57.91 27.13,57.91 ACO_8-15.2 | v44.04,44.65 v44.04,53.49 | 53.65,37.19 53.03,37.8 R8.2 | 53.65,37.19 v56.39,34.44 | 53.65,37.19 56.69,40.23 56.69,41 59.28,43.59 59.28,48.77 60.81,50.29 63.7,50.29 78.94,65.53 88.09,65.53 89.15,66.6 89.15,67.21 88.54,67.82 80.16,67.82 74.22,73.76 74.22,85.19 70.87,88.54 58.06,88.54 54.71,91.9 54.1,91.9 ACC=0_8-15.14
  Bottom 0.152: v39.32,56.39 41.15,56.39 v44.04,53.49 | ACCUMULATOR_8-15.2 40.39,41 v44.04,44.65 48.31,44.65 51.66,41.3 51.66,40.69 52.88,39.47 52.88,37.95 R8.2 | v56.39,34.44 56.39,24.38 54.1,22.1 54.1,11.73 ALU.2
AC9  (via drill 0.35)
  Top 0.152: ACCUMULATOR_8-15.5 48.01,40.84 48.01,37.95 R9.2 47.85,37.8 44.35,34.29 v40.23,34.29 32.92,34.29 28.04,39.17 v10.67,39.17 | v30.79,72.54 30.79,64.92 27.13,61.27 27.13,60.5 ACO_8-15.3 | v43.13,89.76 45.11,89.76 48.77,93.42 55.17,93.42 56.54,92.05 ACC=0_8-15.13
  Bottom 0.152: v40.23,34.29 44.96,29.57 44.96,11.28 45.87,10.36 48.62,10.36 48.92,10.67 50.44,10.67 51.36,11.58 51.97,11.58 ALU.4 | v30.79,72.54 34.29,76.05 34.29,79.55 39.17,84.43 39.17,85.8 39.62,86.26 | v43.13,89.76 39.62,86.26 | v10.67,39.17 10.06,39.17 7.32,41.91 7.32,64.16 17.07,73.91 17.07,77.57 30.94,91.44 34.44,91.44 39.62,86.26
AC10  (via drill 0.35)
  Top 0.152: v44.96,35.97 43.13,37.8 R10.2 | v34.9,76.35 34.9,68.28 | 34.9,68.28 34.9,64.01 30.02,59.13 27.13,59.13 26.21,60.05 26.21,60.81 26.98,61.57 26.98,62.94 ACO_8-15.4 | v44.65,90.37 45.26,90.37 48.62,93.73 57.3,93.73 58.98,92.05 ACC=0_8-15.12 | v48.01,44.04 48.01,44.5 51.66,48.16 51.66,48.92 v43.59,57 | v39.01,58.52 39.01,65.08 35.81,68.28 34.9,68.28
  Bottom 0.152: 49.68,40.84 46.79,37.95 43.13,37.95 R10.2 | 49.68,40.84 50.44,40.84 ACCUMULATOR_8-15.6 49.68,40.84 | v44.96,35.97 46.94,33.98 46.94,11.28 47.55,10.67 48.46,10.67 49.38,11.58 49.99,11.58 ALU.6 | v34.9,76.35 34.9,79.7 39.47,84.28 39.47,85.19 v44.65,90.37 | 49.68,40.84 49.68,42.37 v48.01,44.04 | v43.59,57 40.08,57 39.01,58.06 v39.01,58.52
AC11  (via drill 0.35)
  Top 0.152: v55.78,35.97 55.78,38.56 58.06,40.84 ACCUMULATOR_8-15.9 | v30.18,68.58 27.13,65.53 ACO_8-15.5 26.98,65.38 26.06,64.47 v20.42,64.47 | v47.24,88.7 50.29,91.75 50.29,92.51 50.9,93.12 54.56,93.12 55.47,92.2 55.47,91.59 56.24,90.83 60.5,90.83 61.57,91.9 ACC=0_8-15.11 | v17.98,64.47 17.98,62.33 13.11,57.45 12.34,57.45 11.43,56.54 11.43,40.23 12.19,39.47 32.61,39.47 34.14,37.95 37.95,37.95 R11.2
  Bottom 0.152: R11.2 38.1,37.8 41.6,37.8 42.52,36.88 54.1,36.88 58.06,40.84 ACCUMULATOR_8-15.9 | v55.78,35.97 55.78,24.23 48.16,16.61 48.16,11.73 ALU.8 | v30.18,68.58 30.18,69.49 39.78,79.1 39.78,85.04 43.43,88.7 v47.24,88.7 | v20.42,64.47 v17.98,64.47
AC12  (via drill 0.35)
  Top 0.152: v39.47,35.97 34.9,35.97 33.07,37.8 R12.2 | ACC=0_8-15.6 61.72,84.28 61.72,80.01 70.87,70.87 70.87,68.28 73.3,65.84 73.3,60.35 63.55,50.6 60.2,50.6 58.22,48.62 ACCUMULATOR_8-15.12
  Bottom 0.152: 55.63,50.14 57.15,48.62 58.06,48.62 ACCUMULATOR_8-15.12 | 55.63,50.14 46.63,59.13 32.61,59.13 31.7,60.05 31.7,62.18 27.13,66.75 27.13,67.97 ACO_8-15.6 | 55.63,50.14 54.41,48.92 54.41,47.85 53.03,46.48 44.35,46.48 39.17,41.3 39.17,39.78 38.86,39.47 37.8,39.47 36.27,37.95 33.07,37.95 R12.2 | v39.47,35.97 45.87,29.57 45.87,11.73 ALU.10
AC13  (via drill 0.35)
  Top 0.152: v31.55,34.29 28.04,37.8 R13.2 | v42.06,60.5 40.39,58.83 40.23,58.83 39.62,58.22 39.62,57.45 40.54,56.54 42.52,56.54 50.14,48.92 | 50.14,48.92 50.44,48.62 ACCUMULATOR_8-15.15 50.14,48.92 | 50.14,48.92 v45.26,44.04
  Bottom 0.152: v31.55,34.29 31.55,33.07 42.06,22.55 42.06,15.39 43.89,13.56 43.89,11.73 ALU.12 | ACO_8-15.7 26.98,70.56 26.98,69.19 26.21,68.43 26.21,65.08 32.46,58.83 35.36,58.83 44.2,49.99 49.07,49.99 50.44,48.62 ACCUMULATOR_8-15.15 | v42.06,60.5 42.82,61.27 42.82,61.87 52.43,71.48 52.43,74.22 58.98,80.77 58.98,84.28 ACC=0_8-15.5 | v45.26,44.04 44.5,44.04 41.76,41.3 41.76,40.69 40.23,39.17 37.95,39.17 35.66,36.88 32.61,36.88 32,37.49 32,38.1 33.68,39.78 38.71,39.78 38.86,39.93 38.86,41.91 38.71,42.06 34.44,42.06 30.33,37.95 28.04,37.95 R13.2
AC14  (via drill 0.35)
  Top 0.152: v34.29,65.84 34.29,70.1 31.24,73.15 27.13,73.15 ACO_8-15.8 | v24.54,36.27 23.01,37.8 R14.2 | v42.22,61.57 42.67,61.57 52.27,51.97 v52.27,49.99
  Bottom 0.152: v34.29,65.84 39.62,65.84 40.54,66.75 | 40.54,66.75 42.82,69.04 47.4,69.04 47.7,69.34 48.62,69.34 52.12,72.85 52.12,79.86 56.54,84.28 ACC=0_8-15.4 | 52.58,49.68 53.49,49.68 54.1,49.07 54.1,48.01 52.88,46.79 44.2,46.79 43.28,45.87 34.75,45.87 26.82,37.95 23.01,37.95 R14.2 | 52.58,49.68 51.66,48.77 51.66,48.16 50.9,47.4 49.07,47.4 48.01,48.46 ACCUMULATOR_8-15.16 | v24.54,36.27 28.96,31.85 28.96,28.04 41.91,15.09 41.91,11.73 ALU.14 | 40.54,66.75 42.22,65.08 v42.22,61.57 | 52.58,49.68 v52.27,49.99
AC15  (via drill 0.35)
  Top 0.152: 56.84,73.61 61.72,73.61 64.01,75.89 NOT_GATE.1 | 56.84,73.61 56.08,73.61 TRIPLE_AND_GATE.13 | ACO_8-15.9 26.98,75.74 26.98,77.11 21.95,82.14 21.95,85.04 22.55,85.65 28.19,85.65 30.18,83.67 46.18,83.67 48.01,85.5 52.88,85.5 53.95,84.43 ACC=0_8-15.3 54.1,84.28 56.84,81.53 56.84,73.61 | v38.25,46.48 40.23,48.46 ACCUMULATOR_8-15.19 | v19.66,36.27 18.14,37.8 R15.2
  Bottom 0.152: v38.25,46.48 30.33,46.48 21.79,37.95 18.14,37.95 R15.2 | v19.66,36.27 28.96,26.98 28.96,25.45 39.93,14.48 39.93,11.73 ALU.16 | ACO_8-15.9 26.98,75.59 26.98,74.22 25.91,73.15 25.91,62.94 32,56.84 36.88,56.84 44.04,49.68 45.87,49.68 46.48,49.07 46.48,48.01 45.87,47.4 41.45,47.4 40.39,48.46 ACCUMULATOR_8-15.19
ACI
  Top 0.152: AND_GATE.4 88.09,69.34 87.78,69.34 86.72,68.28 86.11,68.28 84.12,70.26 84.12,86.87 79.1,91.9 79.1,92.51 77.11,94.49 18.59,94.49 6.25,82.14 6.25,63.7 5.33,62.79 5.33,55.93 9.75,51.51 10.67,51.51 11.12,51.97 11.12,55.47 10.21,56.39 BUS.17
ACO
  Top 0.152: ACO_0-7.1 40.39,55.47 34.9,55.47 32.61,57.76 ACO_0-7.19 32.46,57.76 30.18,55.47 27.13,55.47 ACO_8-15.1 26.98,55.47 26.98,56.54 24.69,58.83 20.12,58.83 19.2,57.91 ACO_8-15.19
  Bottom 0.152: ACO_8-15.19 19.05,57.76 14.02,57.76 12.8,56.54 BUS.18
B0
  Bottom 0.152: ACCUMULATOR_0-7.3 77.72,41.15 60.35,58.52 53.19,58.52 52.88,58.22 48.46,58.22 47.24,59.44 40.23,59.44 39.32,60.35 32.61,60.35 ACO_0-7.18 32.46,60.5 32.46,61.87 28.35,65.99 28.35,75.74 27.13,76.96 18.75,76.96 17.98,76.2 17.98,72.08 7.62,61.72 7.62,42.22 9.3,40.54 10.06,40.54 BUS.1
B1  (via drill 0.35)
  Top 0.152: v28.04,59.74 31.24,62.94 32.46,62.94 ACO_0-7.17 | v25.3,57.3 25.3,51.97 v24.23,50.9 | v80.31,35.97 79.86,35.97 77.27,33.38 14.63,33.38 v13.41,34.59
  Bottom 0.152: v28.04,59.74 27.74,59.74 v25.3,57.3 | v24.23,50.9 24.23,47.4 25.45,46.18 25.45,45.57 19.36,39.47 13.41,39.47 | 13.41,39.47 12.19,39.47 11.12,40.54 11.12,41.45 10.21,42.37 BUS.3 | v80.31,35.97 80.31,41 ACCUMULATOR_0-7.4 | 13.41,39.47 v13.41,34.59
B2  (via drill 0.35)
  Top 0.152: v8.23,42.52 8.23,38.41 13.87,32.77 85.34,32.77 v87.63,35.05
  Bottom 0.152: ACO_0-7.16 32.61,65.53 33.07,65.53 34.29,66.75 37.95,66.75 40.54,69.34 47.24,69.34 47.55,69.65 48.46,69.65 51.82,73 51.82,80.16 55.47,83.82 55.47,84.89 57.61,87.02 87.02,87.02 89.46,84.58 89.46,82.6 93.42,78.64 93.42,53.19 89.15,48.92 89.15,47.09 88.09,46.02 88.09,41.15 ACCUMULATOR_0-7.7 88.09,41 89.31,39.78 89.31,37.19 87.63,35.51 v87.63,35.05 | v8.23,42.52 BUS.5
B3  (via drill 0.35)
  Top 0.152: v35.51,67.67 35.51,61.11 40.39,56.24 41.3,56.24 41.45,56.08 41.45,54.71 37.03,50.29 v19.51,50.29 | v88.7,35.66 82.91,35.66 80.31,33.07 14.02,33.07 8.84,38.25 8.84,48.46 9.75,49.38 10.67,49.38 11.12,48.92 11.12,47.4 10.21,46.48 BUS.7
  Bottom 0.152: v35.51,67.67 35.2,67.97 32.61,67.97 ACO_0-7.15 | v19.51,50.29 19.51,47.85 13.11,41.45 12.34,41.45 11.12,42.67 11.12,45.41 10.21,46.33 BUS.7 | v88.7,35.66 90.53,37.49 90.53,41 ACCUMULATOR_0-7.8
B4  (via drill 0.35)
  Top 0.152: v28.96,68.28 28.19,68.28 v25.15,71.32 | v88.7,44.65 87.48,44.65 84.12,41.3 84.12,40.69 77.11,33.68 15.24,33.68 9.14,39.78 9.14,47.4 10.06,48.31 BUS.9
  Bottom 0.152: v28.96,68.28 29.26,67.97 30.48,67.97 32.46,69.95 32.46,70.56 ACO_0-7.14 | v25.15,71.32 24.84,71.32 19.51,76.66 18.9,76.66 18.29,76.05 18.29,71.93 8.84,62.48 8.84,49.68 10.06,48.46 BUS.9 | v88.7,44.65 88.7,46.18 90.53,48.01 90.53,48.62 ACCUMULATOR_0-7.13
B5  (via drill 0.35)
  Top 0.152: v19.81,67.06 26.82,74.07 30.79,74.07 31.7,73.15 32.46,73.15 ACO_0-7.13 | v71.02,32.16 14.02,32.16 7.62,38.56 7.62,48.01 10.06,50.44 BUS.11
  Bottom 0.152: v19.81,67.06 15.85,67.06 11.12,62.33 11.12,62.03 10.52,61.42 9.75,61.42 9.14,60.81 9.14,51.51 10.06,50.6 BUS.11 | v71.02,32.16 79.25,40.39 79.25,41.6 79.86,42.22 80.62,42.22 87.02,48.62 87.94,48.62 ACCUMULATOR_0-7.14
B6  (via drill 0.35)
  Top 0.152: BUS.13 10.06,52.58 5.64,57 5.64,62.64 6.55,63.55 6.55,81.99 18.75,94.18 31.09,94.18 32,93.27 32,92.35 33.53,90.83 v33.98,90.83 35.05,90.83 38.25,94.03 74.98,94.03 76.5,92.51 76.5,83.97 76.2,83.67 v76.2,73
  Bottom 0.152: v33.98,90.83 33.98,78.33 32.61,76.96 32.61,75.74 ACO_0-7.12 | v76.2,73 76.81,73 80.31,69.49 80.31,48.77 ACCUMULATOR_0-7.17
B7  (via drill 0.35)
  Top 0.152: v11.12,66.14 11.12,58.06 10.52,57.45 9.75,57.45 9.14,56.84 9.14,55.47 10.06,54.56 BUS.15 | v74.07,47.55 75.74,47.55 76.81,48.62 77.72,48.62 ACCUMULATOR_0-7.18 | v51.36,58.83 47.85,62.33 47.55,62.33 39.62,70.26 39.62,71.02 41.45,72.85 41.45,76.05 39.32,78.18 32.61,78.18 ACO_0-7.11
  Bottom 0.152: v11.12,66.14 17.37,72.39 17.37,76.05 18.59,77.27 27.43,77.27 28.35,78.18 32.46,78.18 ACO_0-7.11 | v74.07,47.55 71.78,47.55 60.5,58.83 v51.36,58.83
B8
  Top 0.152: ACO_8-15.18 19.05,60.35 17.98,60.35 13.11,55.47 12.34,55.47 11.73,54.86 11.73,41.45 12.65,40.54 BUS.2 12.8,40.54 15.85,40.54 21.79,46.48 25.15,46.48 26.98,44.65 38.1,44.65 41.76,41 42.82,41 ACCUMULATOR_8-15.3
B9
  Top 0.152: ACCUMULATOR_8-15.4 45.26,41 44.35,41 40.39,44.96 27.13,44.96 25.3,46.79 21.64,46.79 17.37,42.52 12.8,42.52 BUS.4
  Bottom 0.152: ACO_8-15.17 19.05,62.94 18.59,62.94 13.11,57.45 12.34,57.45 11.43,56.54 11.43,43.74 12.65,42.52 BUS.4
B10  (via drill 0.35)
  Top 0.152: 48.62,71.93 47.7,71.93 47.09,71.32 47.09,70.56 48.01,69.65 48.01,68.43 TRIPLE_AND_GATE.4 | 48.62,71.93 55.63,64.92 58.06,64.92 64.01,70.87 NOT_GATE.3 | v18.29,51.51 18.29,58.37 18.75,58.83 19.2,58.83 20.42,60.05 20.42,63.4 19.2,64.62 19.2,65.38 ACO_8-15.16 | v24.84,45.87 30.94,39.78 45.87,39.78 46.48,40.39 46.48,41 47.55,42.06 50.9,42.06 51.97,41 52.88,41 ACCUMULATOR_8-15.7 | 48.62,71.93 48.62,72.85 48.92,73.15 48.92,73.91 48.46,74.37 47.7,74.37 46.48,73.15 46.48,66.14 56.08,56.54 v56.08,52.12
  Bottom 0.152: 18.29,50.9 18.29,49.99 12.8,44.5 BUS.6 | 18.29,50.9 v18.29,51.51 | v24.84,45.87 19.81,50.9 18.29,50.9 | v56.08,52.12 59.28,48.92 59.28,47.24 53.03,41 ACCUMULATOR_8-15.7
B11
  Top 0.152: 56.69,48.92 55.93,49.68 55.02,49.68 38.71,65.99 38.71,73.46 35.2,76.96 32.61,76.96 30.33,74.68 26.98,74.68 20.42,68.12 19.2,68.12 ACO_8-15.15 | 56.69,48.92 56.69,42.06 55.63,41 ACCUMULATOR_8-15.8 55.47,41 54.1,42.37 44.96,42.37 42.06,45.26 31.39,45.26 29.57,47.09 21.49,47.09 20.88,46.48 12.8,46.48 BUS.8 | 56.69,48.92 58.67,50.9 63.4,50.9 73,60.5 73,63.55 70.71,65.84 64.16,65.84 NOT_GATE.5
  Bottom 0.152: NOT_GATE.5 64.16,65.99 64.16,66.75 71.17,73.76 71.17,73.91 71.63,74.37 88.09,74.37 AND_GATE.2
B12
  Top 0.152: ACCUMULATOR_8-15.13 55.47,48.46 54.56,48.46 49.53,43.43 44.35,43.43 41.91,45.87 31.24,45.87 28.8,48.31 12.8,48.31 BUS.10
  Bottom 0.152: ACO_8-15.14 19.2,70.56 19.2,70.26 21.03,68.43 21.03,57.91 19.36,56.24 15.85,56.24 13.11,53.49 12.34,53.49 11.73,52.88 11.73,49.38 12.65,48.46 BUS.10
B13  (via drill 0.35)
  Top 0.152: v21.34,56.08 21.34,53.95 v19.2,51.82
  Bottom 0.152: v21.34,56.08 21.34,69.65 19.2,71.78 19.2,73 ACO_8-15.13 | BUS.12 12.8,50.6 14.33,52.12 18.59,52.12 18.9,51.82 v19.2,51.82 24.23,51.82 28.96,47.09 51.05,47.09 52.43,48.46 52.88,48.46 ACCUMULATOR_8-15.14
B14
  Bottom 0.152: 41.76,51.51 44.65,48.62 45.26,48.62 ACCUMULATOR_8-15.17 | 41.76,51.51 36.73,56.54 25.15,56.54 24.69,57 24.69,68.89 19.2,74.37 19.2,75.59 ACO_8-15.12 | 41.76,51.51 39.17,48.92 39.17,48.31 38.25,47.4 37.34,47.4 32.31,52.43 12.8,52.43 BUS.14
B15
  Top 0.152: 13.56,55.32 12.8,54.56 BUS.16 | 13.56,55.32 17.37,59.13 19.05,59.13 20.12,60.2 20.12,63.25 17.98,65.38 17.98,83.97 19.66,85.65 21.03,85.65 21.34,85.34 21.34,83.97 19.2,81.84 19.2,78.33 ACO_8-15.11 | 13.56,55.32 19.2,49.68 40.69,49.68 41.76,48.62 42.82,48.62 ACCUMULATOR_8-15.18
CE
  Top 0.152: OR_GATE.6 12.95,83.97 12.95,83.21 11.73,81.99 11.73,61.42 12.65,60.5 BUS.22
CLK
  Top 0.152: AND_GATE.5 88.09,66.9 80.62,66.9 73,74.52 73,79.7 64.77,87.94 35.97,87.94 31.7,92.2 31.7,93.12 30.94,93.88 18.9,93.88 10.21,85.19 10.21,62.48 BUS.23
GND  (via drill 0.35)
  Top 0.152: OR_GATE.13 5.03,74.07 5.03,76.35 OR_GATE.12 5.18,76.5 5.18,77.88 5.94,78.64 5.94,80.77 5.18,81.53 OR_GATE.10 5.03,81.69 5.03,83.97 OR_GATE.9 | 13.87,85.8 13.87,83.67 12.04,81.84 12.04,81.23 13.87,79.4 13.87,60.35 12.8,59.28 12.8,58.52 BUS.20 | 13.87,85.8 13.11,86.56 OR_GATE.7 | 31.39,84.58 30.63,84.58 SKIPCOND.5 | 31.39,84.58 32.92,84.58 SKIPCOND.6 33.07,84.58 35.51,84.58 SKIPCOND.7 35.66,84.58 38.1,84.58 SKIPCOND.8 38.25,84.58 40.54,84.58 SKIPCOND.9 40.69,84.58 43.13,84.58 SKIPCOND.10 43.28,84.73 46.79,84.73 47.85,85.8 62.79,85.8 64.16,84.43 ACC=0_8-15.7 64.31,84.43 66.6,84.43 ACC=0_8-15.8 66.75,84.28 66.75,78.79 71.93,73.61 NOT_GATE.13 71.93,73.46 71.17,72.69 71.17,70.56 71.93,69.8 71.93,68.43 NOT_GATE.11 | 13.87,85.8 17.37,85.8 25.15,93.57 30.79,93.57 31.39,92.96 31.39,84.58 | ACCUMULATOR_8-15.10 60.66,41 72.69,41 ACCUMULATOR_0-7.1 | C4.1 6.71,12.04 6.71,16.92 C3.1 6.71,17.07 6.71,21.95 C2.1 6.71,22.1 6.71,26.98 C1.1 | ACC=0_8-15.10 64.31,92.05 66.6,92.05 ACC=0_8-15.9 66.75,92.05 67.82,93.12 73.3,93.12 74.37,92.05 75.29,92.05 ACC=0_0-7.15 | SC_800.K 68.73,5.03 68.73,9.91 SC_400.K 68.73,10.06 68.73,14.94 SC_000.K 68.73,15.09 68.73,20.57 | AND_GATE.9 96.16,64.47 96.16,66.75 AND_GATE.10 96.01,66.9 96.01,68.28 95.25,69.04 95.25,71.17 96.01,71.93 AND_GATE.12 96.16,72.08 96.16,74.37 AND_GATE.13 96.01,74.52 95.25,75.29 95.25,77.27 90.68,81.84 90.68,84.28 ACC=0_0-7.8 90.68,84.43 90.68,91.9 ACC=0_0-7.9 90.53,92.05 88.24,92.05 ACC=0_0-7.10 88.09,92.05 87.02,93.12 85.04,93.12 84.43,92.51 84.43,91.59 88.09,87.94 88.09,84.43 ACC=0_0-7.7
  Top 0.152: v97.08,50.9 97.08,48.16 95.71,46.79 95.71,41.15 ACCUMULATOR_0-7.10 95.56,41 95.56,23.93 93.42,21.79 69.95,21.79 68.73,20.57 | v61.87,20.88 63.7,20.88 63.86,21.03 68.28,21.03 68.73,20.57
  Bottom 0.152: OR_GATE.7 12.95,86.56 7.62,86.56 5.18,84.12 OR_GATE.9 | ACO_8-15.10 27.13,78.33 27.13,81.23 30.48,84.58 SKIPCOND.5 | ACO_0-7.10 40.54,78.33 40.54,84.58 SKIPCOND.9 | TRIPLE_AND_GATE.7 48.16,60.66 54.86,60.66 55.63,59.89 63.25,59.89 64.01,60.66 NOT_GATE.7 64.16,60.81 71.63,68.28 71.93,68.28 NOT_GATE.11 | 30.94,38.1 29.72,36.88 16.61,36.88 6.86,27.13 C1.1 | 30.94,38.1 33.68,40.84 37.64,40.84 ACCUMULATOR_8-15.1 | 58.06,36.58 60.5,39.01 60.5,40.84 ACCUMULATOR_8-15.10 | 58.06,36.58 32.46,36.58 30.94,38.1 | ACC=0_0-7.7 88.24,84.28 88.24,83.36 89.76,81.84 89.76,63.4 88.24,61.87 AND_GATE.7 88.09,61.87 87.02,62.94 87.02,69.19 82.6,73.61 72.08,73.61 NOT_GATE.13 | v97.08,50.9 97.08,63.4 96.16,64.31 AND_GATE.9 | ACC=0_0-7.15 75.44,92.05 75.89,92.05 77.27,93.42 86.72,93.42 88.09,92.05 ACC=0_0-7.10 | 58.06,36.58 58.06,31.39 61.42,28.04 61.42,21.34 v61.87,20.88
N$1
  Top 0.152: ACC=0_0-7.1 72.85,84.43 68.73,84.43 64.92,88.24 55.17,88.24 51.51,91.9 ACC=0_8-15.15
N$2
  Top 0.152: SC_800.A 71.32,5.03 88.85,5.03 89.76,5.94 RSC_800.2
N$3
  Top 0.152: SC_400.A 71.32,9.91 74.52,9.91 75.44,8.99 88.85,8.99 89.76,9.91 RSC_400.2
N$4
  Top 0.152: TRIPLE_AND_GATE.1 48.16,75.89 48.46,75.89 55.93,68.43 TRIPLE_AND_GATE.11
  Bottom 0.152: TRIPLE_AND_GATE.11 56.08,68.43 64.01,68.43 NOT_GATE.4
N$5
  Top 0.152: 88.24,64.01 88.24,64.31 AND_GATE.6 88.24,64.01 | 88.24,64.01 91.9,60.35 91.9,52.43 95.56,48.77 ACCUMULATOR_0-7.11 | 88.24,64.01 76.5,52.27 68.73,52.27 66.45,49.99 62.03,49.99 60.66,48.62 ACCUMULATOR_8-15.11
N$6
  Top 0.152: NOT_GATE.9 71.93,63.4 65.23,63.4 64.01,64.62 54.41,64.62 48.16,70.87 TRIPLE_AND_GATE.3
  Bottom 0.152: ACC=0_8-15.1 48.92,84.28 48.92,71.78 48.16,71.02 TRIPLE_AND_GATE.3
N$7
  Top 0.152: TRIPLE_AND_GATE.2 48.01,73.46 46.79,72.24 46.79,68.43 48.01,67.21 48.01,65.99 TRIPLE_AND_GATE.5 48.16,65.84 49.68,64.31 62.33,64.31 63.25,63.4 64.01,63.4 NOT_GATE.6
N$8  (via drill 0.35)
  Top 0.152: v44.2,79.7 31.7,79.7 26.82,84.58 25.45,84.58 SKIPCOND.3 | v44.2,70.26 44.2,67.21 48.01,63.4 TRIPLE_AND_GATE.6 48.16,63.25 v53.49,57.91 | v70.26,21.18 70.26,14.63 74.83,10.06 82.14,10.06 RSC_400.1
  Bottom 0.152: v44.2,70.26 v44.2,79.7 | v70.26,21.18 70.26,47.85 60.2,57.91 v53.49,57.91
N$9  (via drill 0.35)
  Top 0.152: SKIPCOND.2 23.01,84.58 24.23,84.58 29.72,79.1 52.58,79.1 55.02,76.66 55.02,71.93 55.93,71.02 TRIPLE_AND_GATE.12 56.08,71.02 59.59,71.02 62.94,74.37 64.47,74.37 65.08,73.76 65.08,70.71 63.09,68.73 63.09,65.53 63.7,64.92 64.16,64.92 65.08,64.01 v69.8,64.01 | v81.69,40.39 81.69,41.45 v79.55,43.59
  Bottom 0.152: v81.69,40.39 83.97,38.1 83.97,22.4 82.3,20.73 82.3,14.02 RSC_000.1 | v79.55,43.59 79.55,48.01 78.94,48.62 78.94,52.58 69.8,61.72 v69.8,64.01
N$10
  Top 0.152: RSC_000.2 89.76,14.02 83.52,14.02 82.6,14.94 71.32,14.94 SC_000.A
N$11
  Top 0.152: LED15.K 18.14,22.71 22.86,22.71 LED14.K 23.01,22.71 27.89,22.71 LED13.K 28.04,22.71 32.92,22.71 LED12.K 33.07,22.71 37.95,22.71 LED11.K 38.1,22.71 42.98,22.71 LED10.K 43.13,22.71 47.85,22.71 LED9.K 48.01,22.71 52.88,22.71 LED8.K 53.03,22.71 57.91,22.71 LED7.K 58.06,22.71 62.94,22.71 LED6.K 63.09,22.71 67.97,22.71 LED5.K 68.12,22.71 73,22.71 LED4.K 73.15,22.71 77.88,22.71 LED3.K 78.03,22.71 82.91,22.71 LED2.K 83.06,22.71 87.94,22.71 LED1.K 88.09,22.71 92.96,22.71 LED0.K
N$12
  Top 0.152: NOT_GATE.8 71.93,60.81 65.38,60.81 62.94,63.25 56.08,63.25 TRIPLE_AND_GATE.9
N$13
  Top 0.152: TRIPLE_AND_GATE.10 56.08,65.99 56.54,65.99 64.01,73.46 NOT_GATE.2
N$14
  Top 0.152: LED1.A 88.09,25.3 88.09,30.18 R1.1
N$15
  Bottom 0.152: TRIPLE_AND_GATE.8 56.08,60.81 57.76,60.81 70.87,73.91 70.87,74.07 71.93,75.13 86.26,75.13 88.09,76.96 AND_GATE.1
N$16
  Top 0.152: LED2.A 83.06,25.3 83.06,30.18 R2.1
N$17  (via drill 0.35)
  Top 0.152: v32,86.41 v57.91,86.41 | v92.81,56.08 97.69,51.21 97.69,16.61 87.17,6.1 82.3,6.1 RSC_800.1 | v86.41,68.89 86.41,70.26 88.09,71.93 AND_GATE.3
  Bottom 0.152: v57.91,86.41 85.19,86.41 86.72,84.89 86.72,84.28 89.46,81.53 89.46,74.07 88.24,72.85 88.24,72.08 AND_GATE.3 | v32,86.41 29.72,86.41 28.04,84.73 SKIPCOND.4 | v92.81,56.08 88.09,60.81 87.94,60.81 86.41,62.33 v86.41,68.89
N$18
  Top 0.152: LED3.A 78.03,25.3 78.03,30.18 R3.1
N$19
  Top 0.152: LED4.A 73,25.3 73,30.18 R4.1
N$20
  Top 0.152: LED5.A 67.97,25.3 67.97,30.18 R5.1
N$21
  Top 0.152: LED6.A 63.09,25.3 63.09,30.18 R6.1
N$22
  Top 0.152: LED7.A 58.06,25.3 58.06,30.18 R7.1
N$23
  Top 0.152: LED8.A 53.03,25.3 53.03,30.18 R8.1
N$24
  Top 0.152: LED9.A 48.01,25.3 48.01,30.18 R9.1
N$25
  Top 0.152: LED10.A 42.98,25.3 42.98,30.18 R10.1
N$26
  Top 0.152: LED11.A 38.1,25.3 38.1,30.18 R11.1
N$27
  Top 0.152: LED12.A 33.07,25.3 33.07,30.18 R12.1
N$28
  Top 0.152: LED13.A 28.04,25.3 28.04,30.18 R13.1
N$29
  Top 0.152: LED14.A 23.01,25.3 23.01,30.18 R14.1
N$30
  Top 0.152: LED15.A 17.98,25.3 17.98,30.18 R15.1
N$31
  Top 0.152: LED0.A 92.96,25.3 92.96,30.18 R0.1
N$32
  Bottom 0.152: OR_GATE.1 12.95,71.48 12.95,72.69 12.04,73.61 12.04,76.81 19.36,84.12 19.36,86.56 25.3,92.51 SKIPCOND.18
N$33
  Bottom 0.152: OR_GATE.2 13.11,74.07 13.11,75.29 21.95,84.12 21.95,86.56 27.89,92.51 SKIPCOND.17
N$34
  Top 0.152: OR_GATE.3 13.11,76.5 13.11,78.94 OR_GATE.4
N$35
  Top 0.152: OR_GATE.5 13.11,81.69 15.24,81.69 25.15,91.59 29.57,91.59 30.48,92.51 SKIPCOND.16
SC  (via drill 0.35)
  Top 0.152: v19.2,69.34 18.9,69.65 18.75,69.65 18.29,70.1 18.29,82.6 20.27,84.58 SKIPCOND.1
  Bottom 0.152: SKIPCOND.1 20.42,84.73 20.42,86.26 26.36,92.2 26.36,92.96 25.76,93.57 23.93,93.57 23.01,92.66 SKIPCOND.19 | v19.2,69.34 20.42,68.12 20.42,66.75 20.12,66.45 18.75,66.45 13.72,61.42 12.19,61.42 11.28,60.5 10.21,60.5 BUS.21
VCC  (via drill 0.35)
  Top 0.152: TRIPLE_AND_GATE.14 55.93,76.05 55.93,79.86 51.51,84.28 ACC=0_8-15.2 | v90.07,46.63 73.61,46.63 72.85,47.4 72.85,48.62 ACCUMULATOR_0-7.20 | ACC=0_0-7.2 75.29,84.43 75.29,89.61 73,91.9 ACC=0_0-7.16 | C4.2 9.3,12.04 9.3,16.92 C3.2 9.3,17.07 9.3,21.95 C2.2 9.3,22.1 9.3,26.98 C1.2 | v6.25,62.33 10.06,58.52 BUS.19 | v20.42,58.22 20.42,57.91 19.2,56.69 19.2,55.47 ACO_8-15.20 | v47.24,90.98 48.16,91.9 48.92,91.9 ACC=0_8-15.16
  Bottom 0.152: ACC=0_8-15.16 49.07,91.9 49.07,86.72 51.36,84.43 ACC=0_8-15.2 | 72.08,76.96 72.08,81.08 75.29,84.28 ACC=0_0-7.2 | 72.08,76.96 72.08,76.05 NOT_GATE.14 | ACC=0_0-7.16 73,91.9 74.07,90.83 75.74,90.83 76.5,91.59 76.5,92.2 77.42,93.12 86.11,93.12 86.72,92.51 86.72,91.9 96.01,82.6 96.01,77.11 AND_GATE.14 96.01,76.96 95.25,76.2 95.25,54.56 91.9,51.21 91.9,48.46 v90.07,46.63 | 72.08,76.96 63.4,76.96 62.48,76.05 56.08,76.05 TRIPLE_AND_GATE.14 | ACO_8-15.20 19.2,55.47 25.6,55.47 26.36,56.24 31.7,56.24 32.46,55.47 ACO_0-7.20 32.61,55.32 37.64,50.29 37.64,48.62 ACCUMULATOR_8-15.20 | C1.2 9.14,26.98 8.08,26.98 7.16,26.06 6.4,26.06 5.79,26.67 5.79,61.87 v6.25,62.33 6.25,70.26 5.18,71.32 OR_GATE.14 5.18,71.48 5.18,72.54 19.05,86.41 19.05,91.29 20.27,92.51 SKIPCOND.20 20.42,92.66 21.64,93.88 33.07,93.88 35.97,90.98 v47.24,90.98 | v20.42,58.22 20.42,62.94 19.51,63.86 17.37,63.86 12.95,59.44 11.12,59.44 10.21,58.52 BUS.19

### Text on the board
bNames: MARIE PC / Accumulator / Architecture design by: Dr. Linda Null / Hardware implementation by: Richard Bowser